# Altium project 充电扩展板.PrjPcb
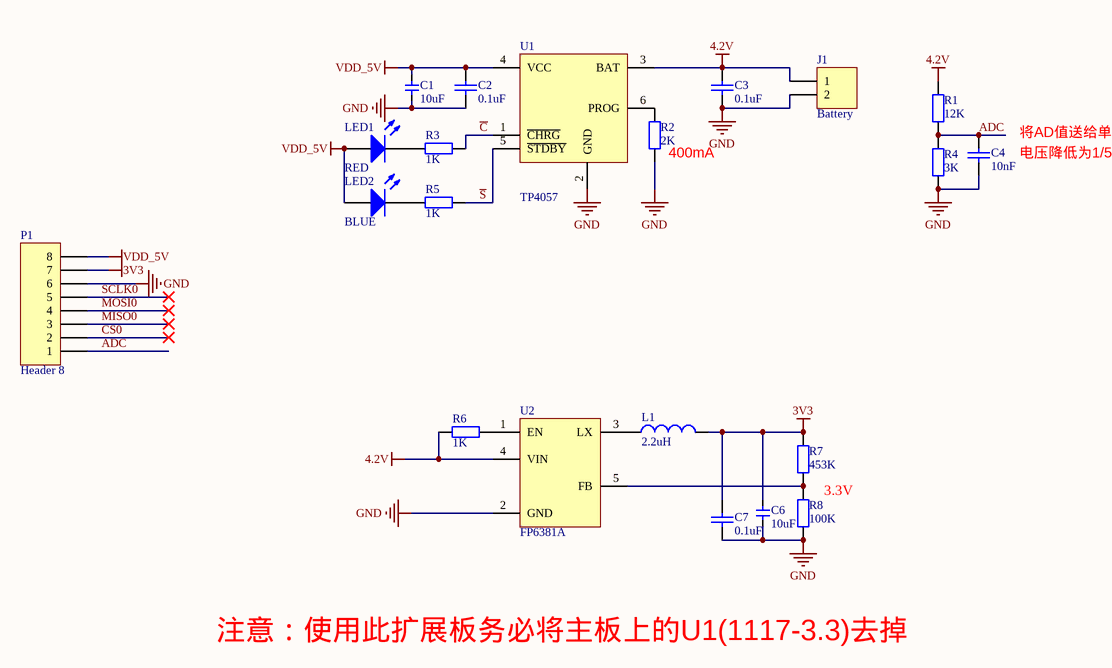
[diagram p0: 充电扩展板.SchDoc]
1 sheet, 21 parts. Net scope: global (net labels, ports and power ports of the same name join across sheets).
Board file: 充电扩展板.PcbDoc

## Sheet 充电扩展板.SchDoc: SD²电池扩展板
size A4; DrawnBy: Chu Xin; Address1: L3, 12a Rodborough Rd; Address2: Frenchs Forest; Address3: NSW; Address4: Australia 2086; Revision: Rev 1.0; SheetNumber: 1; SheetTotal: 1; PageSetup: Record=PageOptions|CenterHorizontal=True|CenterVertical=True|PrintScale=1.00|XCorrection=1.00|YCorrection=1.00|PrintKind=0|BorderSize=5000000|LeftOffset=0|BottomOffset=0|Orientation=2|PaperLength=1000|PaperWidth=1000|Scale=100|PaperSource=7|PrintQuality=-3|MediaType=1|DitherType=10|PrintScaleMode=1|PaperKind=A4|PaperIndex=9

### Parts
C1  10uF  [C_0603]
C2  0.1uF  [C_0603]
C3  0.1uF  [C_0603]
C4  10nF  [C_0603]
C6  10uF  [C_0603]
C7  0.1uF  [C_0603]
J1  Battery  [C_1812]
L1  2.2uH  [CD32]
LED1  RED  [0603/1608 LEDR]
LED2  BLUE  [0603/1608 LEDB]
P1  Header 8  [FFC_0.5_8]
R1  12K  [R_0603]
R2  2K  [R_0603]
R3  1K  [R_0603]
R4  3K  [R_0603]
R5  1K  [R_0603]
R6  1K  [R_0603]
R7  453K  [R_0603]
R8  100K  [R_0603]
U1  TP4057  [SOT23-6-Y]
U2  FP6381A  [SOT23-5-Y]

### Nets
3V3: C6.2 C7.1 L1.2 P1.7 R7.1
4.2V: C3.1 J1.1 R1.1 R6.2 U1.3(BAT) U2.4(VIN)
GND: C1.1 C2.2 C3.2 C4.2 C6.1 C7.2 J1.2 P1.6 R2.2 R4.2 R8.2 U1.2(GND) U2.2(GND)
VDD_5V: C1.2 C2.1 LED1.1(A) LED2.1(A) P1.8 U1.4(VCC)
ADC: C4.1 P1.1 R1.2 R4.1
~{C}: R3.1 U1.1(~{CHRG})
CS0: P1.2
MISO0: P1.3
MOSI0: P1.4
~{S}: R5.1 U1.5(~{STDBY})
SCLK0: P1.5
NetL1_1: L1.1 U2.3(LX)
NetLED1_2: LED1.2(K) R3.2
NetLED2_2: LED2.2(K) R5.2
NetR2_1: R2.1 U1.6(PROG)
NetR6_1: R6.1 U2.1(EN)
NetR7_2: R7.2 R8.1 U2.5(FB)

### Notes on the sheet
- (near R2) 400mA
- (near C4) 电压降低为1/5
- (near C4) 将AD值送给单片机
- 3.3V
- 注意：使用此扩展板务必将主板上的U1(1117-3.3)去掉
- 电路名称:
- 编号:
- Sch drawn by Misaka
- 版本:
- 作者:
- 时间:

### Library data of the parts
C1 C6 = 电容-0402: Capacitor; Value: 0.1u
C2-C4 C7 = Cap: Capacitor; Value: 100pF; Published: 8-Jun-2000; LatestRevisionDate: 17-Jul-2002; LatestRevisionNote: Re-released for DXP Platform.; PackageReference: RAD-0.3; Publisher: Altium Limited; PackageDescription: Radial Cap, Thru-Hole; 2 Leads; 0.3 in Pin Spacing
J1 = Header 2: Header, 2-Pin; LatestRevisionDate: 17-Jul-2002; LatestRevisionNote: Re-released for DXP Platform.; Publisher: Altium Limited
L1 = Inductor: Code_IEC: 1005; Value: 10mH; Published: 8-Jun-2000; LatestRevisionDate: 29-May-2009; LatestRevisionNote: IPC-7351 Footprint Added.; PackageReference: 0402-A; Publisher: Altium Limited; PackageDescription: Chip Inductor; Code_JEITA: 0402
LED1 LED2 = LED0: Typical INFRARED GaAs LED; Published: 8-Jun-2000; LatestRevisionDate: 08-Jul-2005; LatestRevisionNote: Mech Layer 1 removed.; PackageReference: LED-0; Publisher: Altium Limited; PackageDescription: LED; 2 Leads
P1 = Header 8: Header, 8-Pin; LatestRevisionDate: 17-Jul-2002; LatestRevisionNote: Re-released for DXP Platform.; Publisher: Altium Limited
R1 R2 R4 R7 R8 = Res2: Resistor; Value: 1K; Published: 8-Jun-2000; LatestRevisionDate: 17-Jul-2002; LatestRevisionNote: Re-released for DXP Platform.; PackageReference: AXIAL-0.4; Publisher: Altium Limited; PackageDescription: Axial Device, Thru-Hole; 2 Leads; 0.4 in Pin Spacing
R3 R5 R6 = Res2: Resistor; Published: 8-Jun-2000; LatestRevisionDate: 17-Jul-2002; LatestRevisionNote: Re-released for DXP Platform.; PackageReference: AXIAL-0.4; Publisher: Altium Limited; PackageDescription: Axial Device, Thru-Hole; 2 Leads; 0.4 in Pin Spacing; Value: 1K
U1 = TP4057: 0.5A锂电池充电芯片
U2 = FP6381A: DC-DC  1.5MHz  1.2A